# Altium project cjb.PrjPCB
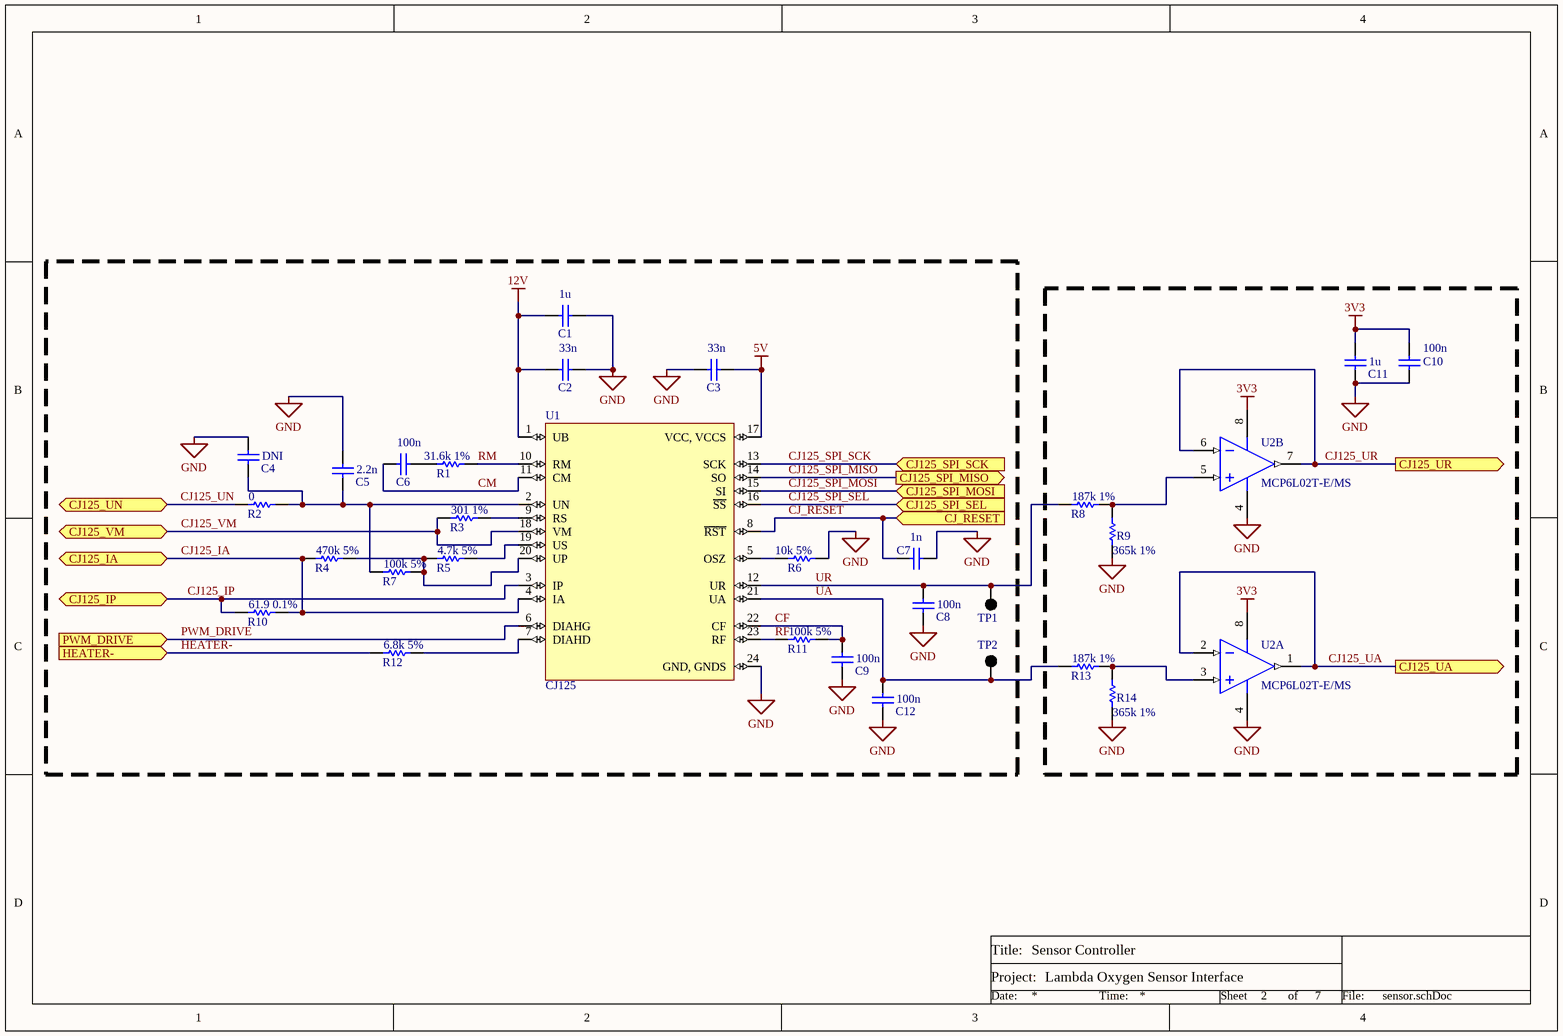
[diagram p0: sensor.schDoc]
ProjectTitle: Lambda Oxygen Sensor Interface
5 sheets, 113 parts. Net scope: hierarchical (ports join the sheet entries above them; power ports are global).
Board file: cjb.PcbDoc
Sheets:
  sensor.schDoc
  microcontroller.SchDoc
  power.SchDoc
  breakout.SchDoc
  thermocouple.SchDoc

## Sheet sensor.schDoc: Sensor Controller
size A4; SheetNumber: 2; SheetTotal: 7

### Parts
C1  value 1u  [1206]  (hidden comment: Generic 1206 Capacitor)
C2  value 33n  [0805]  (hidden comment: Generic 0805 Capacitor)
C3  value 33n  [0805]  (hidden comment: Generic 0805 Capacitor)
C4  value DNI  [0805]  (hidden comment: Generic 0805 Capacitor)
C5  value 2.2n  [0805]  (hidden comment: Generic 0805 Capacitor)
C6  value 100n  [0805]  (hidden comment: Generic 0805 Capacitor)
C7  value 1n  [0805]  (hidden comment: Generic 0805 Capacitor)
C8  value 100n  [0805]  (hidden comment: Generic 0805 Capacitor)
C9  value 100n  [0805]  (hidden comment: Generic 0805 Capacitor)
C10  value 100n  [0805]  (hidden comment: Generic 0805 Capacitor)
C11  value 1u  [1206]  (hidden comment: Generic 1206 Capacitor)
C12  value 100n  [0805]  (hidden comment: Generic 0805 Capacitor)
R1  value 31.6k 1%  [0603]  (hidden comment: Generic 0603 Resistor)
R2  value 0  [0603]  (hidden comment: Generic 0603 Resistor)
R3  value 301 1%  [0603]  (hidden comment: Generic 0603 Resistor)
R4  value 470k 5%  [0603]  (hidden comment: Generic 0603 Resistor)
R5  value 4.7k 5%  [0603]  (hidden comment: Generic 0603 Resistor)
R6  value 10k 5%  [0603]  (hidden comment: Generic 0603 Resistor)
R7  value 100k 5%  [0603]  (hidden comment: Generic 0603 Resistor)
R8  value 187k 1%  [0603]  (hidden comment: Generic 0603 Resistor)
R9  value 365k 1%  [0603]  (hidden comment: Generic 0603 Resistor)
R10  value 61.9 0.1%  [0603]  (hidden comment: Generic 0603 Resistor)
R11  value 100k 5%  [0603]  (hidden comment: Generic 0603 Resistor)
R12  value 6.8k 5%  [0603]  (hidden comment: Generic 0603 Resistor)
R13  value 187k 1%  [0603]  (hidden comment: Generic 0603 Resistor)
R14  value 365k 1%  [0603]  (hidden comment: Generic 0603 Resistor)
TP1  5001  [KSTN-5001]  (value not drawn)
TP2  5001  [KSTN-5001]  (value not drawn)
U1  CJ125  [SOIC-24]
U2  MCP6L02T-E/MS  [MSOP8_M]  (parts A,B of 2)

### Ports
CJ125_IA (bidir), CJ125_IP (bidir), CJ125_SPI_MISO (out), CJ125_SPI_MOSI (in), CJ125_SPI_SCK (in), CJ125_SPI_SEL (in), CJ125_UA (out), CJ125_UN (bidir), CJ125_UR (out), CJ125_VM (bidir), CJ_RESET (in), HEATER- (in), PWM_DRIVE (in)

### Nets
3V3: C10.2 C11.2 U2.8(VDD)
5V: C3.1 U1.17(VCC,_VCCS)
12V: C1.1 C2.2 U1.1(UB)
GND: C1.2 C2.1 C3.2 C4.2 C5.2 C7.2 C8.1 C9.1 C10.1 C11.1 C12.1 R6.2 R9.1 R14.1 U1.24(GND,_GNDS) U2.4(VSS)
CF: C9.2 R11.2 U1.22(CF)
CJ125_IA: R4.1 R10.2 U1.4(IA) ; port CJ125_IA
CJ125_IP: R10.1 U1.3(IP) ; port CJ125_IP
CJ125_SPI_MISO: U1.14(SO) ; port CJ125_SPI_MISO
CJ125_SPI_MOSI: U1.15(SI) ; port CJ125_SPI_MOSI
CJ125_SPI_SCK: U1.13(SCK) ; port CJ125_SPI_SCK
CJ125_SPI_SEL: U1.16(~{SS}) ; port CJ125_SPI_SEL
CJ125_UA: U2.1(VOUTA) U2.2(VINA-) ; port CJ125_UA
CJ125_UN: R2.1 ; port CJ125_UN
CJ125_UR: U2.6(VINB-) U2.7(VOUTB) ; port CJ125_UR
CJ125_VM: R3.1 U1.18(VM) ; port CJ125_VM
CJ_RESET: C7.1 U1.8(~{RST}) ; port CJ_RESET
CM: C6.1 U1.11(CM)
HEATER-: R12.1 ; port HEATER-
PWM_DRIVE: U1.6(DIAHG) ; port PWM_DRIVE
RF: R11.1 U1.23(RF)
RM: R1.2 U1.10(RM)
UA: C12.2 R13.1 TP2.1 U1.21(UA)
UR: C8.2 R8.1 TP1.1 U1.12(UR)
NetC4_1: C4.1 C5.1 R2.2 R7.1 U1.2(UN)
NetC6_2: C6.2 R1.1
NetR3_2: R3.2 U1.9(RS)
NetR4_2: R4.2 R5.1 R7.2 U1.20(UP)
NetR5_2: R5.2 U1.19(US)
NetR6_1: R6.1 U1.5(OSZ)
NetR8_2: R8.2 R9.2 U2.5(VINB+)
NetR12_2: R12.2 U1.7(DIAHD)
NetR13_2: R13.2 R14.2 U2.3(VINA+)

### Notes on the sheet
- Title:
- Project:
- Date:
- Time:
- Sheet
- of
- File:
- Title
- Size:
- E
- Number:
- Revision:

### Library data of the parts
C1 C11 = C_1206: Specifications: *
C2-C10 C12 = C_0805: Specifications: *
R1-R14 = R_0603: Specifications: *
TP1 TP2 = TP5001: Test Point, Black, 1-Pin THD, RoHS, Bulk; Manufacturer: Keystone; Other Names: 5001K; Catalog Drawings: 5000Series; Alternate Color: 5004K-ND / -TESTPOINTPCMINI.040"DYELLOW / 5003K-ND / -TESTPOINTPCMINI.040"DORANGE / 5002K-ND / -TESTPOINTPCMINI.040"DWHITE / 5000K-ND / -TESTPOINTPCMINI.040"DRED; Kits: DKTGRS232C-KIT-ND / -TTLCONVERTER; Online Catalog: ColorCodedTestPoints; Datasheet URL: https://ciiva.com/datasheet-click-2917627?src=ciiva&sig=bd195616; Mounting Type: 0.040"(1.02mm)HoleDiameter; Family: TestPoints; RoHS Information: RoHSComplianceStatement; Datasheet Version: Rev. G, 12/2008; Color: Black; Category: TestandMeasurement; Standard Package: 100; Manufacturer URL: http://www.keyelco.com/; Material: Base,Nylon46,UL94V-0; Type: PCTestPoint,Miniature; Terminal: 0.010"x0.020"(0.25mmx0.51mm)PhosphorBronzeWire,SilverPlated; Series: THM; Packaging: Bulk
U1 = CJ125: 5V 2Mbaud SMT Lambda Probe Interface IC - SOIC-24; Supplier 1: Future Electronics; Package Reference: SOIC-24; Supplier Part Number 1: 0272240104
U2 = MCP6L02: 1 MHz, 85 Î¼A Dual Op Amp, 8-Pin MSOP, Extended Temperature Range, Tape and Reel; ComponentLink2URL: http://ww1.microchip.com/downloads/en/DeviceDoc/22140b.pdf; PackageDescription: 8-Lead Plastic Micro Small Outline Package (MS) [MSOP]; ComponentLink1URL: http://www.microchip.com/; ComponentLink1Description: Manufacturer URL; RevisionNote: URLs added. DatasheetVersion updated.; PackageVersion: revBB, Aug-2009; ComponentLink3URL: http://www.microchip.com/stellent/groups/techpub_sg/documents/packagingspec/en012702.pdf; ComponentLink2Description: Datasheet; ComponentLink3Description: Package Specification; DatasheetVersion: revB, Sep-2011; PackageReference: MSOP-MS8

## Sheet microcontroller.SchDoc: Microcontroller
size A4; SheetNumber: 3; SheetTotal: 7
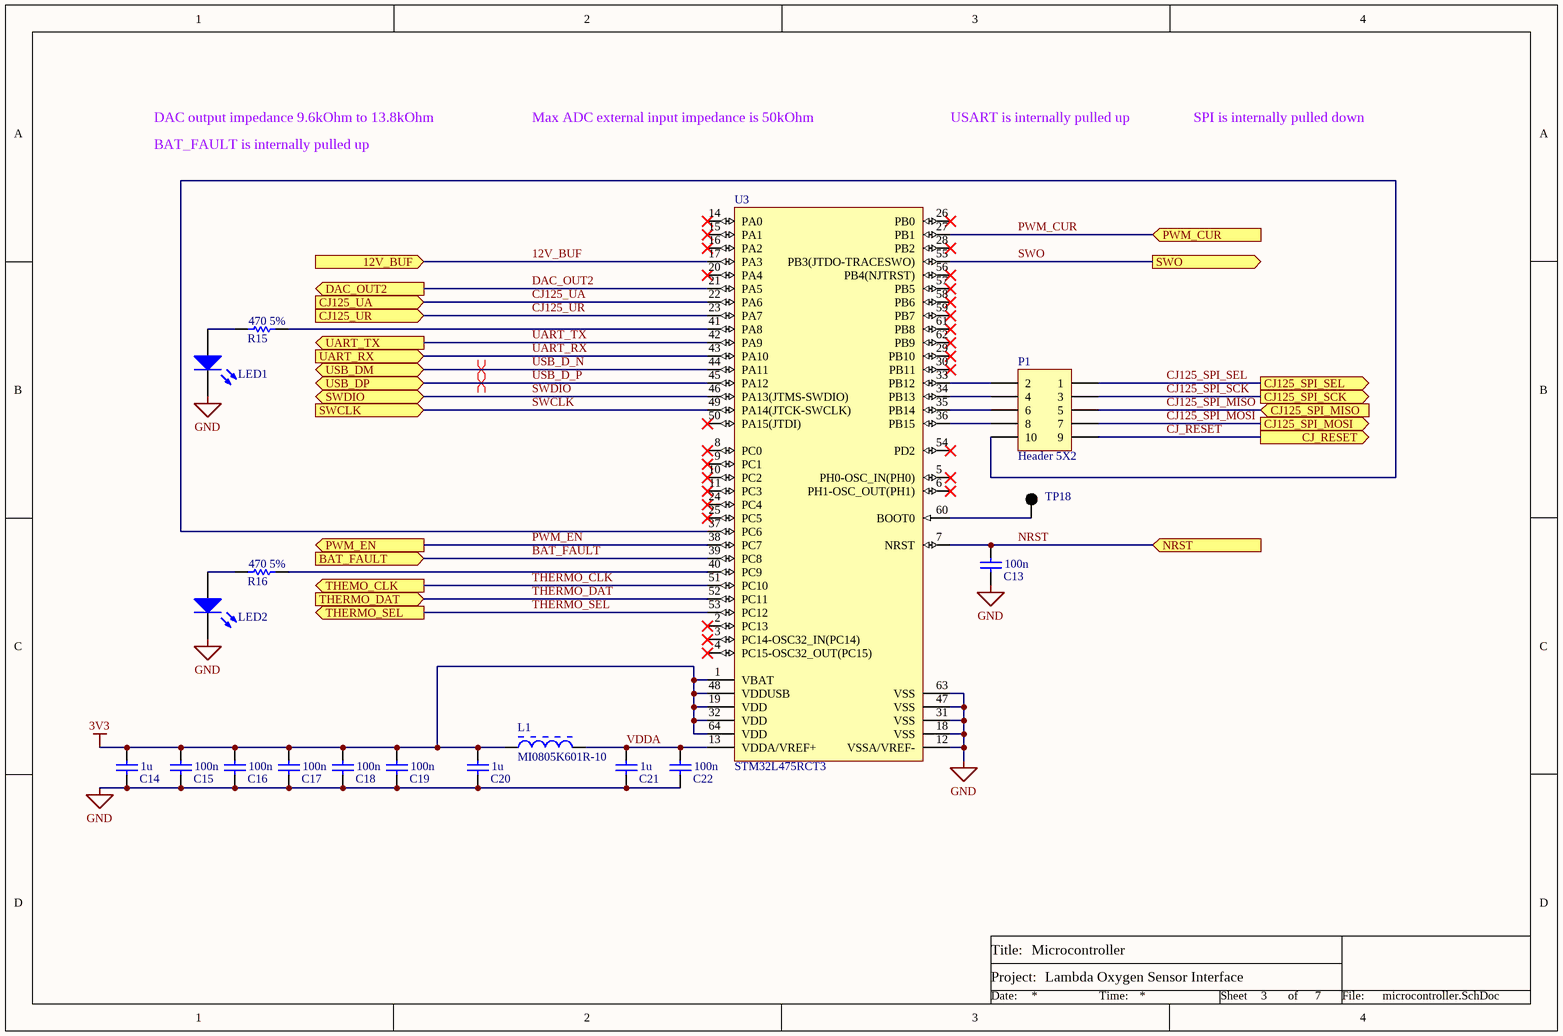
[diagram p1: microcontroller.SchDoc]

### Parts
C13  value 100n  [0805]  (hidden comment: Generic 0805 Capacitor)
C14  value 1u  [1206]  (hidden comment: Generic 1206 Capacitor)
C15  value 100n  [0805]  (hidden comment: Generic 0805 Capacitor)
C16  value 100n  [0805]  (hidden comment: Generic 0805 Capacitor)
C17  value 100n  [0805]  (hidden comment: Generic 0805 Capacitor)
C18  value 100n  [0805]  (hidden comment: Generic 0805 Capacitor)
C19  value 100n  [0805]  (hidden comment: Generic 0805 Capacitor)
C20  value 1u  [1206]  (hidden comment: Generic 1206 Capacitor)
C21  value 1u  [1206]  (hidden comment: Generic 1206 Capacitor)
C22  value 100n  [0805]  (hidden comment: Generic 0805 Capacitor)
L1  MI0805K601R-10  [0805]
LED1  150080SS75000  [0805_A]  (value not drawn)
LED2  150080SS75000  [0805_A]  (value not drawn)
P1  Header 5X2  [HDR2X5]
R15  value 470 5%  [0603]  (hidden comment: Generic 0603 Resistor)
R16  value 470 5%  [0603]  (hidden comment: Generic 0603 Resistor)
TP18  5001  [KSTN-5001]  (value not drawn)
U3  STM32L475RCT3  [STM-LQFP64_L]

### Ports
12V_BUF (in), BAT_FAULT (in), CJ125_SPI_MISO (in), CJ125_SPI_MOSI (out), CJ125_SPI_SCK (out), CJ125_SPI_SEL (out), CJ125_UA (in), CJ125_UR (in), CJ_RESET (out), DAC_OUT2 (out), NRST (in), PWM_CUR (in), PWM_EN (out), SWCLK (in), SWDIO (bidir), SWO (out), THEMO_CLK (out), THERMO_DAT (in), THERMO_SEL (out), UART_RX (in), UART_TX (out), USB_DM (bidir), USB_DP (bidir)

### Nets
3V3: C14.2 C15.2 C16.2 C17.2 C18.2 C19.2 C20.2 L1.1 U3.1(VBAT) U3.19(VDD) U3.32(VDD) U3.48(VDDUSB) U3.64(VDD)
GND: C13.1 C14.1 C15.1 C16.1 C17.1 C18.1 C19.1 C20.1 C21.1 C22.1 LED1.1(K) LED2.1(K) U3.12(VSSA/VREF-) U3.18(VSS) U3.31(VSS) U3.47(VSS) U3.63(VSS)
12V_BUF: U3.17(PA3) ; port 12V_BUF
BAT_FAULT: U3.39(PC8) ; port BAT_FAULT
CJ125_SPI_MISO: P1.5 ; port CJ125_SPI_MISO
CJ125_SPI_MOSI: P1.7 ; port CJ125_SPI_MOSI
CJ125_SPI_SCK: P1.3 ; port CJ125_SPI_SCK
CJ125_SPI_SEL: P1.1 ; port CJ125_SPI_SEL
CJ125_UA: U3.22(PA6) ; port CJ125_UA
CJ125_UR: U3.23(PA7) ; port CJ125_UR
CJ_RESET: P1.9 ; port CJ_RESET
DAC_OUT2: U3.21(PA5) ; port DAC_OUT2
NRST: C13.2 U3.7(NRST) ; port NRST
PWM_CUR: U3.27(PB1) ; port PWM_CUR
PWM_EN: U3.38(PC7) ; port PWM_EN
SWCLK: U3.49(PA14(JTCK-SWCLK)) ; port SWCLK
SWDIO: U3.46(PA13(JTMS-SWDIO)) ; port SWDIO
SWO: U3.55(PB3(JTDO-TRACESWO)) ; port SWO
THERMO_CLK: U3.51(PC10) ; port THEMO_CLK
THERMO_DAT: U3.52(PC11) ; port THERMO_DAT
THERMO_SEL: U3.53(PC12) ; port THERMO_SEL
UART_RX: U3.43(PA10) ; port UART_RX
UART_TX: U3.42(PA9) ; port UART_TX
USB_D_N: U3.44(PA11) ; port USB_DM
USB_D_P: U3.45(PA12) ; port USB_DP
VDDA: C21.2 C22.2 L1.2 U3.13(VDDA/VREF+)
NetLED1_2: LED1.2(A) R15.1
NetLED2_2: LED2.2(A) R16.1
NetP1_2: P1.2 U3.33(PB12)
NetP1_4: P1.4 U3.34(PB13)
NetP1_6: P1.6 U3.35(PB14)
NetP1_8: P1.8 U3.36(PB15)
NetP1_10: P1.10 U3.37(PC6)
NetR15_2: R15.2 U3.41(PA8)
NetR16_2: R16.2 U3.40(PC9)
NetTP18_1: TP18.1 U3.60(BOOT0)

Not connected (* = marked no-connect by the designer): U3 2(PC13)* 3(PC14-OSC32_IN(PC14))* 4(PC15-OSC32_OUT(PC15))* 5(PH0-OSC_IN(PH0))* 6(PH1-OSC_OUT(PH1))* 8(PC0)* 9(PC1)* 10(PC2)* 11(PC3)* 14(PA0)* 15(PA1)* 16(PA2)* 20(PA4)* 24(PC4)* 25(PC5)* 26(PB0)* 28(PB2)* 29(PB10)* 30(PB11)* 50(PA15(JTDI))* 54(PD2)* 56(PB4(NJTRST))* 57(PB5)* 58(PB6)* 59(PB7)* 61(PB8)* 62(PB9)*

### Layout directives
differential pair: USB_D_N, USB_D_P

### Notes on the sheet
- DAC output impedance 9.6kOhm to 13.8kOhm
- BAT_FAULT is internally pulled up
- Max ADC external input impedance is 50kOhm
- USART is internally pulled up
- SPI is internally pulled down
- Title
- Title:
- Project:
- Size:
- Date:
- File:
- E
- Number:
- Time:
- Revision:
- Sheet
- of

### Library data of the parts
C13 C15-C19 C22 = C_0805: Specifications: *
C14 C20 C21 = C_1206: Specifications: *
L1 = MI0805K: Chip Bead for Power Filtering, 1500 mA, 600 Ohm, -40 to 125 degC, 0805 (2012 Metric), RoHS, Tape and Reel; Manufacturer: Laird; Filter Type: PowerLine; Current Rating (Max): 1.5A; Catalog Drawings: (HI,HZ,LI,MI)0805Series_1.10mmMax.Height; Impedance @ Frequency: 600Ohm@100MHz; Number of Lines: 1; DC Resistance (DCR) (Max): 100mOhm; Other Names: 240-2390-1; Kits: 240-2227-ND-KITEMIFERRITEBEADCHIPSMD; Online Catalog: MISeries; Standard Package: 1; Datasheet Version: Rev. A, 01/2004; Height (Max): 0.043"(1.10mm); Category: Filters; Operating Temperature: -40degC~125degC; Package Description: 2-Pin Surface Mount Device, Body 2 x 1.25 mm; Package / Case: 0805(2012Metric); Package Reference: MI0805K601R-10-2; Packaging: CutTape(CT); Ratings: -; Mounting Type: SurfaceMount; Datasheet URL: https://datasheet.ciiva.com/3082/mi0805k601r-10-a-vp-3082219.pdf; Size / Dimension: 0.079"Lx0.049"W(2.00mmx1.25mm); Family: FerriteBeadsandChips; Manufacturer URL: https://www.lairdtech.com; Series: MI
LED1 LED2 = LED_0805: SMD mono-color Chip LED, WL-SMCW, Super Red; Manufacturer: Wuerth Elektronik; PackageReference: 0805_A; ComponentLink2URL: http://katalog.we-online.com/led/datasheet/150080SS75000.pdf; ComponentLink1URL: http://www.we-online.com; Color: Super Red; ComponentLink2Description: Datasheet; ComponentLink1Description: Manufacturer URL; PartNumber: 150080SS75000
P1 = Header 5X2: Header, 5-Pin, Dual row; LatestRevisionDate: 17-Jul-2002; LatestRevisionNote: Re-released for DXP Platform.; Publisher: Altium Limited
R15 R16 = R_0603: Specifications: *
TP18 = TP5001: as TP1 on sheet sensor; Datasheet URL: https://ciiva.com/datasheet-click-2917627?src=ciiva&sig=bd195616; Mounting Type: 0.040"(1.02mm)HoleDiameter; Family: TestPoints; RoHS Information: RoHSComplianceStatement; Datasheet Version: Rev. G, 12/2008; Color: Black; Category: TestandMeasurement; Standard Package: 100; Manufacturer URL: http://www.keyelco.com/; Material: Base,Nylon46,UL94V-0; Type: PCTestPoint,Miniature; Terminal: 0.010"x0.020"(0.25mmx0.51mm)PhosphorBronzeWire,SilverPlated; Series: THM; Packaging: Bulk
U3 = STM32L475RCT3: Ultra-Low-Power ARM Cortex-M4 32-bit MCU+FPU, 256 KB Flash, 128 KB Internal RAM, 51 I/Os, 64-Pin LQFP, -40 to 125 degC, Tray; Operating Frequency(F) (Processor speed) (MHz): 80; Internal RAM Size (kB): 128; I/Os (High Current): 51; D/A Converter: 2; Supply Voltage(Vcc) min (V): 1.71; FLASH Size (Prog) (kB): 256; Package: LQFP64; Packing: Tray; DatasheetVersion: Rev. 4; Mounting Technology: Surface Mount; Core: ARM Cortex-M4; Package Description: 64-Pin Low-profile Quad Flat Package, Body 10 x 10 mm, Pitch 0.5 mm; ComponentLink1Description: Datasheet; ComponentLink1URL: http://www.st.com/content/ccc/resource/technical/document/datasheet/90/51/73/d2/53/60/4f/5f/DM00172872.pdf/files/DM00172872.pdf/jcr:content/translations/en.DM00172872.pdf; Supplier 1: Digi-Key; Supplier Part Number 1: 497-16840-ND

## Sheet power.SchDoc: Power
size A4; SheetNumber: 4; SheetTotal: 7
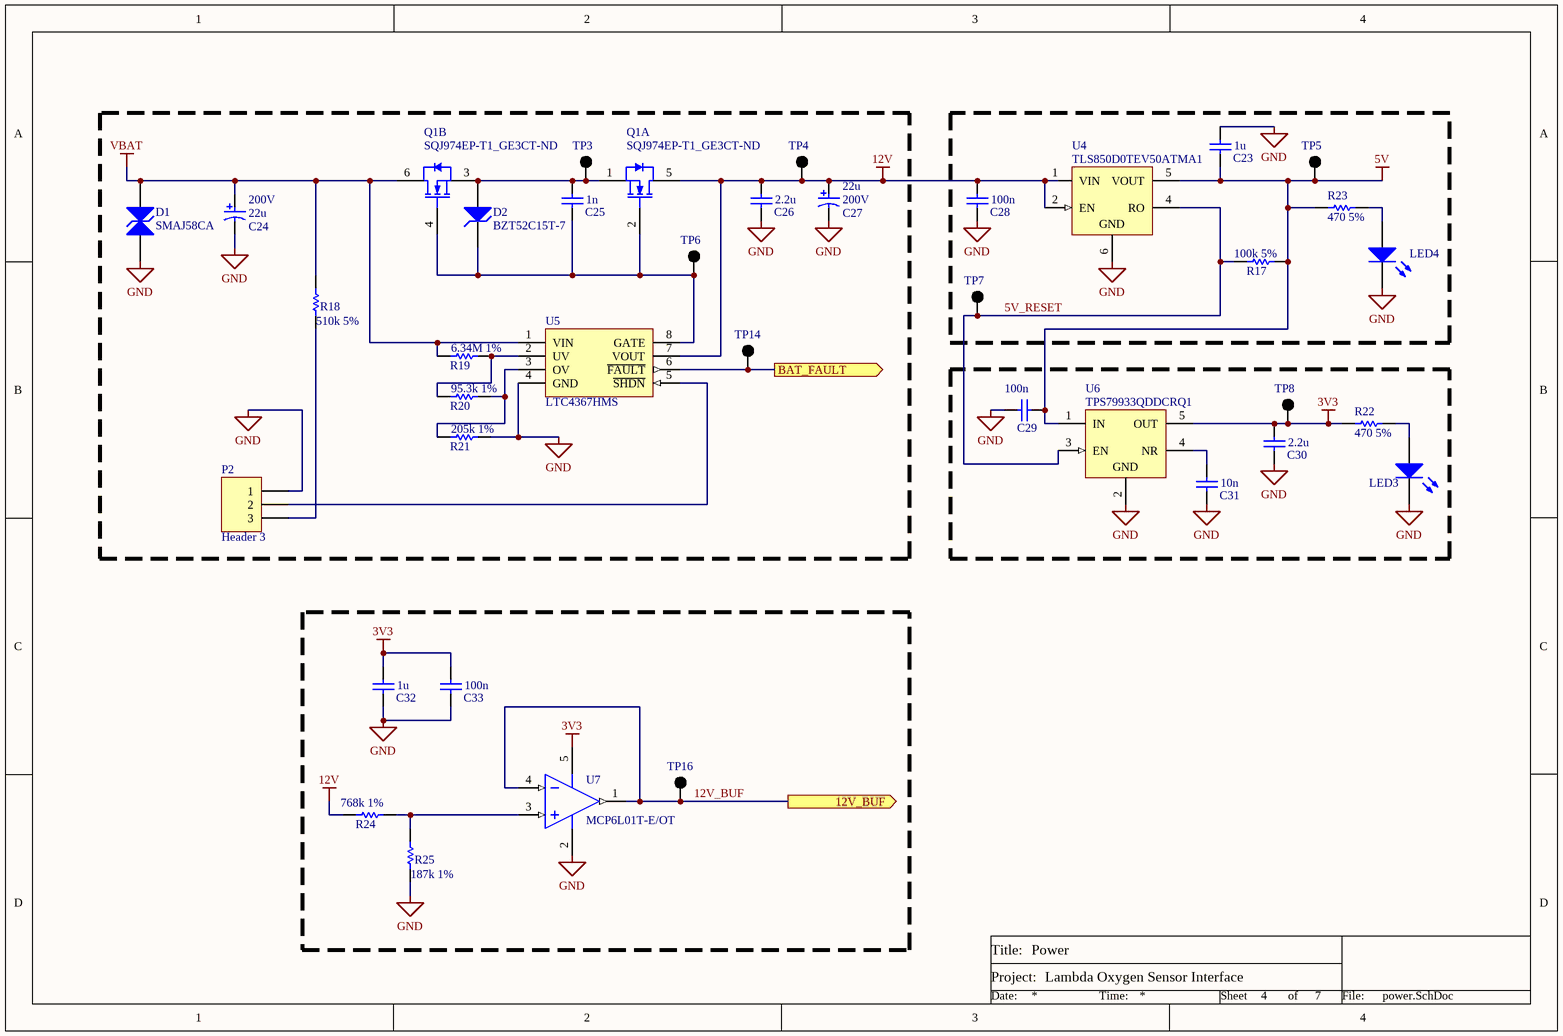
[diagram p2: power.SchDoc]

### Parts
C23  value 1u  [1206]  (hidden comment: Generic 1206 Capacitor)
C24  value 22u  Voltage: 200V  [NIC-UUX2A470MNL1GS_M]  (hidden comment: Generic Electrolytic Capacitor)
C25  value 1n  [0805]  (hidden comment: Generic 0805 Capacitor)
C26  value 2.2u  [1206]  (hidden comment: Generic 1206 Capacitor)
C27  value 22u  Voltage: 200V  [NIC-UUX2A470MNL1GS_M]  (hidden comment: Generic Electrolytic Capacitor)
C28  value 100n  [0805]  (hidden comment: Generic 0805 Capacitor)
C29  value 100n  [0805]  (hidden comment: Generic 0805 Capacitor)
C30  value 2.2u  [1206]  (hidden comment: Generic 1206 Capacitor)
C31  value 10n  [0805]  (hidden comment: Generic 0805 Capacitor)
C32  value 1u  [1206]  (hidden comment: Generic 1206 Capacitor)
C33  value 100n  [0805]  (hidden comment: Generic 0805 Capacitor)
D1  SMAJ58CA  [VISH-DO-214AC-2_M]
D2  BZT52C15T-7  [DIOD-SOD523-2_V]
LED3  150080SS75000  [0805_A]  (value not drawn)
LED4  150080SS75000  [0805_A]  (value not drawn)
P2  Header 3  [HDR1X3]
Q1  SQJ974EP-T1_GE3CT-ND  [VISH-POWERPAKSO-8_A_V]  (parts A,B of 2)
R17  value 100k 5%  [0603]  (hidden comment: Generic 0603 Resistor)
R18  value 510k 5%  [0603]  (hidden comment: Generic 0603 Resistor)
R19  value 6.34M 1%  [0603]  (hidden comment: Generic 0603 Resistor)
R20  value 95.3k 1%  [0603]  (hidden comment: Generic 0603 Resistor)
R21  value 205k 1%  [0603]  (hidden comment: Generic 0603 Resistor)
R22  value 470 5%  [0603]  (hidden comment: Generic 0603 Resistor)
R23  value 470 5%  [0603]  (hidden comment: Generic 0603 Resistor)
R24  value 768k 1%  [0603]  (hidden comment: Generic 0603 Resistor)
R25  value 187k 1%  [0603]  (hidden comment: Generic 0603 Resistor)
TP3  5001  [KSTN-5001]  (value not drawn)
TP4  5001  [KSTN-5001]  (value not drawn)
TP5  5001  [KSTN-5001]  (value not drawn)
TP6  5001  [KSTN-5001]  (value not drawn)
TP7  5001  [KSTN-5001]  (value not drawn)
TP8  5001  [KSTN-5001]  (value not drawn)
TP14  5001  [KSTN-5001]  (value not drawn)
TP16  5001  [KSTN-5001]  (value not drawn)
U4  TLS850D0TEV50ATMA1  [KVU0005A_M]
U5  LTC4367HMS  [MSOP8_M]
U6  TPS79933QDDCRQ1  [DDC0005A_M]
U7  MCP6L01T-E/OT  [DDC0005A_M]

### Ports
12V_BUF (out), BAT_FAULT (out)

### Nets
3V3: C30.2 C32.2 C33.2 R22.2 TP8.1 U6.5(OUT) U7.5(VDD)
5V: C23.1 C29.2 R17.2 R23.2 TP5.1 U4.5(VOUT) U6.1(IN)
12V: C26.2 C27.1 C28.2 Q1.5(G2) R24.1 TP4.1 U4.1(VIN) U4.2(EN) U5.7(VOUT)
GND: C23.2 C24.2 C26.1 C27.2 C28.1 C29.1 C30.1 C31.1 C32.1 C33.1 D1.1(A1) LED3.1(K) LED4.1(K) P2.1 R21.2 R25.1 U4.6(GND) U5.4(GND) U6.2(GND) U7.2(VSS)
VBAT: C24.1 D1.2(A2) Q1.6(G2) R18.2 R19.1 U5.1(VIN)
5V_RESET: R17.1 TP7.1 U4.4(RO) U6.3(EN)
12V_BUF: TP16.1 U7.1(VOUT) U7.4(VIN-) ; port 12V_BUF
BAT_FAULT: TP14.1 U5.6(~{FAULT}) ; port BAT_FAULT
NetC25_1: C25.1 D2.2(K) Q1.2(G2) Q1.4(G2) TP6.1 U5.8(GATE)
NetC25_2: C25.2 D2.1(A) Q1.1(S2) Q1.3(S2) TP3.1
NetC31_2: C31.2 U6.4(NR)
NetLED3_2: LED3.2(A) R22.1
NetLED4_2: LED4.2(A) R23.1
NetP2_2: P2.2 U5.5(~{SHDN})
NetP2_3: P2.3 R18.1
NetR19_2: R19.2 R20.1 U5.2(UV)
NetR20_2: R20.2 R21.1 U5.3(OV)
NetR24_2: R24.2 R25.2 U7.3(VIN+)

### Notes on the sheet
- Title
- Title:
- Project:
- Size:
- Date:
- File:
- E
- Number:
- Time:
- Revision:
- Sheet
- of

### Library data of the parts
C23 C26 C30 C32 = C_1206: Specifications: *
C24 C27 = C_can: Generic PCAP_10x10 Can Aluminum Electrolytic Capacitor
C25 C28 C29 C31 C33 = C_0805: Specifications: *
D1 = SMAJ58CA: Transient Voltage Suppressor, 6.40 to 231 V, 58 V Stand-off Voltage, Bi-Directional, -55 to 155 degC, 2-pin DO-214AC, Pb-Free, Tape and Reel; Manufacturer: Vishay Semiconductor; PartNumber: SMAJ58CA-E3/5A; VWM (V): 58; IFSM: 40 A; VBR Bi-Directional (V): 6.4 to 231; ID (uA): 2; PPPM (W): 400, 300; ComponentLink2Description: Datasheet; ComponentLink1URL: http://www.vishay.com/; ComponentLink2URL: http://www.vishay.com/docs/88390/smaj50a.pdf; PackageReference: DO-214AC-2; Operating Junction and Storage Temperature Range: -55 to 150 degC; DatasheetVersion: 12/8/2013; ComponentLink3Description: Package Specification; RoHS: TRUE; Mounting Technology: Surface Mount; ComponentLink1Description: Manufacturer URL; PackageDescription: 2-Pin DO-214AC (SMA), Body 4.245 x 2.665 mm; ComponentLink3URL: http://www.vishay.com/docs/88390/smaj50a.pdf; Packing: Tape and Reel; Supplier 1: Digi-Key; Supplier Part Number 1: SMAJ58CALFCT-ND
D2 = BZT52C15T: Zener Diode 15V 300mW ±6% Surface Mount SOD-523; Manufacturer: Diodes Inc; PartNumber: BZT52C16-7-F; Maximum Reverse Current: 0.1 uA; Tol V: 5.56% Typ.; Maximum Zener Impedance f: 1 kHz ZZK=200 Ohm; Voltage Zener: 16 V Typ.; Packing: Tape and Reel; Power Max: 500 mW; ComponentLink2URL: http://www.diodes.com/datasheets/ds18004.pdf; PackageDescription: 2-Pin SOD123, Body 2.7 x 1.55 mm, Height 1.45 mm; ComponentLink3Description: Package Specification; Mounting Technology: Surface Mount; PackageReference: SOD123; ComponentLink2Description: Datasheet; RoHS: TRUE; ComponentLink3URL: http://www.diodes.com/datasheets/ap02002.pdf; Operating Temperature: -65 to 150 degC; DatasheetVersion: Rev. 37-2; ComponentLink1Description: Manufacturer URL; ComponentLink1URL: http://www.diodes.com/; PackageVersion: Rev. 79
LED3 LED4 = LED_0805: as LED1 on sheet microcontroller; PackageReference: 0805_A; ComponentLink2URL: http://katalog.we-online.com/led/datasheet/150080SS75000.pdf; ComponentLink1URL: http://www.we-online.com; Color: Super Red; ComponentLink2Description: Datasheet; ComponentLink1Description: Manufacturer URL; PartNumber: 150080SS75000
P2 = Header 3: Header, 3-Pin; LatestRevisionDate: 17-Jul-2002; LatestRevisionNote: Re-released for DXP Platform.; Publisher: Altium Limited
Q1 = SQJ974EP: Mosfet Array 2 N-Channel (Dual) 100V 30A (Tc) 48W Surface Mount PowerPAK® SO-8 Dual; Manufacturer: Vishay; Gate Charge (Qg) @ Vgs: 15nC@10V; FET Feature: Standard; Rds On (Max) @ Id, Vgs: 19mOhm@10A,10V; Drain to Source Voltage (Vdss): 40V; Other Names: SI7288DP-T1-GE3DKR; Online Catalog: N-ChannelStandardFETs; Power - Max: 15.6W; PCN Assembly/Origin: MultipleFabracationChanges09/Jul/2014; Input Capacitance (Ciss) @ Vds: 565pF@20V; Current - Continuous Drain (Id) @ 25°C: 20A; Vgs(th) (Max) @ Id: 2.8V@250µA; Package Reference: POWERPAKSO-8; Datasheet URL: http://www.vishay.com/docs/65366/si7288dp.pdf; Package Description: 8-Pin Surface Mount Device, Body 6.15 x 5.155 mm, Pitch 1.27 mm; Manufacturer URL: http://www.vishay.com/; Package / Case: PowerPAK®SO-8Dual; Category: DiscreteSemiconductorProducts; Mounting Type: SurfaceMount; Standard Package: 1; Mounting Technology: SurfaceMount; Series: TrenchFET®; Datasheet Version: Rev. A, 10/2009; Supplier Device Package: PowerPAK®SO-8Dual; Family: FETs-Arrays; Packaging: Digi-Reel®; FET Type: 2N-Channel(Dual)
R17-R25 = R_0603: Specifications: *
TP3-TP8 TP14 TP16 = TP5001: as TP1 on sheet sensor; Datasheet URL: https://ciiva.com/datasheet-click-2917627?src=ciiva&sig=bd195616; Mounting Type: 0.040"(1.02mm)HoleDiameter; Family: TestPoints; RoHS Information: RoHSComplianceStatement; Datasheet Version: Rev. G, 12/2008; Color: Black; Category: TestandMeasurement; Standard Package: 100; Manufacturer URL: http://www.keyelco.com/; Material: Base,Nylon46,UL94V-0; Type: PCTestPoint,Miniature; Terminal: 0.010"x0.020"(0.25mmx0.51mm)PhosphorBronzeWire,SilverPlated; Series: THM; Packaging: Bulk
U4 = TLS850D0TE: Linear Voltage Regulator IC  1 Output  500mA PG-TO252-5; PartNumber: TPS7A6150QKVURQ1; Manufacturer: Texas Instruments; Vin(Min)(V): 4; Fixed Output Options(V): 5; Vdo(Typ)(mV): 300; Accuracy(%): 2; Iq(Typ)(mA): 0.02; Iout(Max)(A): 0.3; SubFamily: Single Channel LDO; Vin(Max)(V): 40; Eco-Plan: Green (RoHS & no Sb/Br); PackageReference: KVU0005A; ComponentLink2URL: http://www.ti.com/general/docs/lit/getliterature.tsp?genericPartNumber=TPS7A6150-Q1&fileType=pdf; PackageDescription: 5-Pin Plastic Flange Mount, Body 6.1 x 6.6 mm, Pitch 1.14 mm; Vout Adj(Max)(V): 5; ComponentLink1Description: Manufacturer URL; ComponentLink1URL: http://www.ti.com/; DatasheetVersion: SLVSA62G; ComponentLink2Description: Datasheet; Mounting Technology: Surface Mount; PackageVersion: 4205521-3/D; Vout Adj(Min)(V): 5; ComponentLink3Description: Package Specification; Code_JEDEC: TO-252; ComponentLink3URL: http://www.ti.com/lit/ml/mpsf019/mpsf019.pdf; Supplier 1: Digi-Key; Supplier Part Number 1: 296-36856-6-ND
U5 = LTC4367: 100V Overvoltage, Undervoltage and Reverse Supply Protection Controller; ComponentLink1Description: Manufacturer URL; ComponentLink3Description: Package Specification; ComponentLink2URL: http://cds.linear.com/docs/en/datasheet/4356fa.pdf; ComponentLink3URL: http://cds.linear.com/docs/en/packaging/05081661_F_MS.pdf; ComponentLink1URL: http://www.linear.com/; ComponentLink2Description: Datasheet
U6 = TPS79933: Single Output High PSRR LDO, 200 mA, Fixed 3.3 V Output, 2.7 to 6.5 V Input, with Low IQ, 5-pin SOT (DDC), -40 to 125 degC, Green (RoHS & no Sb/Br); Manufacturer: Texas Instruments; Accuracy(%): 2; Vin(Max)(V): 6.5; SubFamily: Single Channel LDO; Iout(Max)(A): 0.2; Vdo(Typ)(mV): 90; Fixed Output Options(V): 3.3; Iq(Typ)(mA): 0.04; Rating: Automotive; Vin(Min)(V): 2.7; ComponentLink2Description: Datasheet; ComponentLink3Description: Package Specification; PackageVersion: 4204403-2/E; ComponentLink1URL: http://www.ti.com/; ComponentLink3URL: http://www.ti.com/litv/pdf/mpds123d; ComponentLink2URL: http://www.ti.com/general/docs/lit/getliterature.tsp?genericPartNumber=TPS79933-Q1&fileType=pdf; PackageReference: DDC0005A; PackageDescription: 5-Pin Plastic Small Outline, Body 2.9 x 1.6 mm, 0.95 mm Pitch; ComponentLink4Description: URL Link1; PartNumber: TPS79933QDDCRQ1; DatasheetVersion: SBVS097E; Mounting Technology: Surface Mount; ComponentLink1Description: Manufacturer URL; Eco-Plan: Green (RoHS & no Sb/Br); Vout Adj(Max)(V): 3.3; Vout Adj(Min)(V): 3.3; ComponentLink4URL: Samples URL:http://www.ti.com/product/tps79933-q1#samples; Code_JEDEC: MO-193
U7 = MCP6L01: 1 MHz, 85 uA Op Amp, 5-Pin SOT-23, Extended Temperature Range; Code_IPC: SOT23-5; ComponentLink3Description: Package Specification; PackageVersion: revBB, Aug-2009; ComponentLink3URL: http://www.microchip.com/stellent/groups/techpub_sg/documents/packagingspec/en012702.pdf; ComponentLink1Description: Manufacturer URL; DatasheetVersion: revB, Sep-2011; PackageDescription: 5-Lead Plastic Small Outline Transistor (OT) [SOT-23]; PackageReference: SOT-23-OT5; ComponentLink1URL: http://www.microchip.com/; ComponentLink2Description: Datasheet; ComponentLink2URL: http://ww1.microchip.com/downloads/en/DeviceDoc/22140b.pdf; RevisionNote: URLs added. DatasheetVersion updated.

## Sheet breakout.SchDoc: Pin Breakout
size A4; SheetNumber: 7; SheetTotal: 7
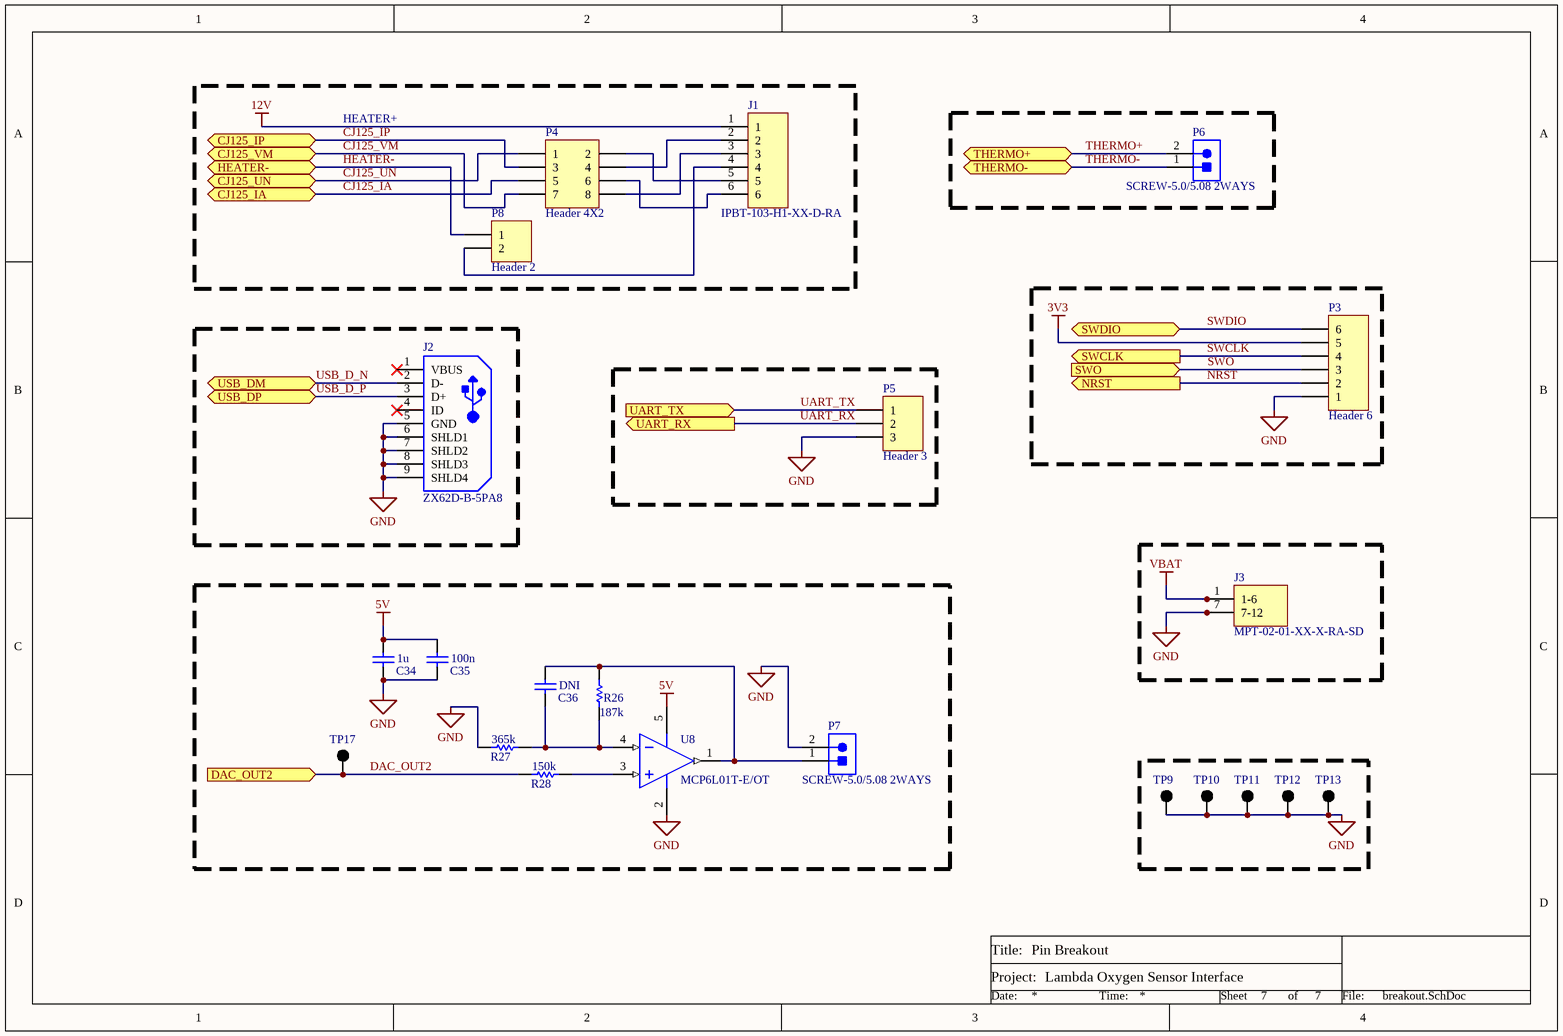
[diagram p3: breakout.SchDoc]

### Parts
C34  value 1u  [1206]  (hidden comment: Generic 1206 Capacitor)
C35  value 100n  [0805]  (hidden comment: Generic 0805 Capacitor)
C36  value DNI  [0805]  (hidden comment: Generic 0805 Capacitor)
J1  IPBT-103-H1-XX-D-RA  [IPBT-103-H1-XX-D-RA]
J2  ZX62D-B-5PA8  [HIRO-ZX62D-B-5PA8_V]
J3  MPT-02-01-XX-X-RA-SD  [MPT-02-01-XX-X-RA-SD]
P3  Header 6  [HDR1X6]
P4  Header 4X2  [HDR2X4]
P5  Header 3  [HDR1X3]
P6  SCREW-5.0/5.08 2WAYS  [Degson_DG126-5.0-02P-14]
P7  SCREW-5.0/5.08 2WAYS  [Degson_DG126-5.0-02P-14]
P8  Header 2  [HDR1X2]
R26  value 187k  [0603]  (hidden comment: Generic 0603 Resistor)
R27  value 365k  [0603]  (hidden comment: Generic 0603 Resistor)
R28  value 150k  [0603]  (hidden comment: Generic 0603 Resistor)
TP9  5001  [KSTN-5001]  (value not drawn)
TP10  5001  [KSTN-5001]  (value not drawn)
TP11  5001  [KSTN-5001]  (value not drawn)
TP12  5001  [KSTN-5001]  (value not drawn)
TP13  5001  [KSTN-5001]  (value not drawn)
TP17  5001  [KSTN-5001]  (value not drawn)
U8  MCP6L01T-E/OT  [DDC0005A_M]

### Blocks framed on the sheet
HEATER+: J1 P4 P8

### Ports
CJ125_IA (bidir), CJ125_IP (bidir), CJ125_UN (bidir), CJ125_VM (bidir), DAC_OUT2 (in), HEATER- (bidir), NRST (out), SWCLK (out), SWDIO (bidir), SWO (in), THERMO+ (bidir), THERMO- (bidir), UART_RX (out), UART_TX (in), USB_DM (bidir), USB_DP (bidir)

### Nets
3V3: P3.5
5V: C34.2 C35.2 U8.5(VDD)
12V: J1.1
GND: C34.1 C35.1 J2.5(GND) J2.6(SHLD1) J2.7(SHLD2) J2.8(SHLD3) J2.9(SHLD4) J3.7(7-12) J3.8 J3.9 J3.10 J3.11 J3.12 P3.1 P5.3 P7.2 R27.1 TP9.1 TP10.1 TP11.1 TP12.1 TP13.1 U8.2(VSS)
VBAT: J3.1(1-6) J3.2 J3.3 J3.4 J3.5 J3.6
CJ125_IA: P4.5 ; port CJ125_IA
CJ125_IP: P4.3 ; port CJ125_IP
CJ125_UN: P4.1 ; port CJ125_UN
CJ125_VM: P4.7 ; port CJ125_VM
DAC_OUT2: R28.1 TP17.1 ; port DAC_OUT2
HEATER-: P8.1 ; port HEATER-
NRST: P3.2 ; port NRST
SWCLK: P3.4 ; port SWCLK
SWDIO: P3.6 ; port SWDIO
SWO: P3.3 ; port SWO
THERMO+: P6.2 ; port THERMO+
THERMO-: P6.1 ; port THERMO-
UART_RX: P5.2 ; port UART_RX
UART_TX: P5.1 ; port UART_TX
USB_D_N: J2.2(D-) ; port USB_DM
USB_D_P: J2.3(D+) ; port USB_DP
NetC36_1: C36.1 R26.1 R27.2 U8.4(VIN-)
NetC36_2: C36.2 P7.1 R26.2 U8.1(VOUT)
NetJ1_2: J1.2 P4.4
NetJ1_3: J1.3 P4.8
NetJ1_4: J1.4 P8.2
NetJ1_5: J1.5 P4.2
NetJ1_6: J1.6 P4.6
NetR28_2: R28.2 U8.3(VIN+)

Not connected (* = marked no-connect by the designer): J2 1(VBUS)* 4(ID)*

### Notes on the sheet
- Title
- Title:
- Project:
- Size:
- Date:
- File:
- E
- Number:
- Time:
- Revision:
- Sheet
- of

### Library data of the parts
C34 = C_1206: Specifications: *
C35 C36 = C_0805: Specifications: *
J1 = IPBT-103-H1-XX-D-RA: 0.165 INCH DOUBLE ROW TERMINAL ASSEMBLY; ComponentLink1Description: Manufacturer URL; ComponentLink3Description: Package Specification; ComponentLink2URL: http://cds.linear.com/docs/en/datasheet/4356fa.pdf; ComponentLink3URL: http://cds.linear.com/docs/en/packaging/05081661_F_MS.pdf; ComponentLink1URL: http://www.linear.com/; ComponentLink2Description: Datasheet
J2 = Micro_USB: Micro-USB Connector Meeting USB 2.0 Standard, -30 to 85 degC, 5-Pin SMD, RoHS, Tape and Reel; Manufacturer: HiroseElectric; Number of Contacts: 5Contact; Current Rating: 1A; Brand: HiroseConnector; Number of Ports: 1Port; Voltage Rating: 30V; Mounting Angle: Right; Gender: Male; Connector Type: Receptacle; RoHS: Details; Package Reference: ZX62D-B-5PA8; Contact Plating: Gold; Product: MicroUSBTypeBConnectors; Shell Plating: Tin; Datasheet Version: 08/2010; Factory Pack Quantity: 2000; Manufacturer URL: https://www.hirose.com; Standard: USB2.0; Datasheet URL: https://datasheet.ciiva.com/22825/0900766b8118f7b1-22825836.pdf; Package Description: 5-Pin Surface Mount Device, Body 7.5 x 5 mm, Pitch 0.65 mm; Operating Temperature Range: -30Cto+85C; Series: ZX; Contact Material: CopperAlloy; Color: Black; Mounting Technology: SurfaceMount; Product Category: USBConnectors; Termination Style: Solder; Packaging: Reel
P3 = Header 6: Header, 6-Pin; LatestRevisionDate: 17-Jul-2002; LatestRevisionNote: Re-released for DXP Platform.; Publisher: Altium Limited
P4 = Header 4X2: Header, 4-Pin, Dual row; LatestRevisionDate: 17-Jul-2002; LatestRevisionNote: Re-released for DXP Platform.; Publisher: Altium Limited
P5 = Header 3: Header, 3-Pin; LatestRevisionDate: 17-Jul-2002; LatestRevisionNote: Re-released for DXP Platform.; Publisher: Altium Limited
P6 P7 = Screw_Header_2: Socket, Screw Terminal Block, 2 Way, 5.0 mm Pitch, 90 Degree Angle, Through-Hole; Manufacturer: No Vendor; Insulation Resistance: 5000 MOhm / 1000 V; Contact Resistance: 20 mOhm; Rated Current: 25 A; Poles: 2; Rated Voltage: 300 V; PartNumber: SCREW-5.0/5.08 2WAYS; ComponentLink1Description: Datasheet; ComponentLink1URL: 5mm screw terminal in SVN; Mounting Technology: Through Hole; PackageDescription: Socket, Screw Terminal Block, 2 Way, Pitch 5 mm, 90 Degree Angle, Through-Hole; Temperature Range: -40 to 105 degC
P8 = Header 2: Header, 2-Pin; LatestRevisionDate: 17-Jul-2002; LatestRevisionNote: Re-released for DXP Platform.; Publisher: Altium Limited
R26-R28 = R_0603: Specifications: *
TP9-TP13 TP17 = TP5001: as TP1 on sheet sensor; Datasheet URL: https://ciiva.com/datasheet-click-2917627?src=ciiva&sig=bd195616; Mounting Type: 0.040"(1.02mm)HoleDiameter; Family: TestPoints; RoHS Information: RoHSComplianceStatement; Datasheet Version: Rev. G, 12/2008; Color: Black; Category: TestandMeasurement; Standard Package: 100; Manufacturer URL: http://www.keyelco.com/; Material: Base,Nylon46,UL94V-0; Type: PCTestPoint,Miniature; Terminal: 0.010"x0.020"(0.25mmx0.51mm)PhosphorBronzeWire,SilverPlated; Series: THM; Packaging: Bulk
U8 = MCP6L01: as U7 on sheet power; Code_IPC: SOT23-5; ComponentLink3Description: Package Specification; PackageVersion: revBB, Aug-2009; ComponentLink3URL: http://www.microchip.com/stellent/groups/techpub_sg/documents/packagingspec/en012702.pdf; ComponentLink1Description: Manufacturer URL; DatasheetVersion: revB, Sep-2011; PackageDescription: 5-Lead Plastic Small Outline Transistor (OT) [SOT-23]; PackageReference: SOT-23-OT5; ComponentLink1URL: http://www.microchip.com/; ComponentLink2Description: Datasheet; ComponentLink2URL: http://ww1.microchip.com/downloads/en/DeviceDoc/22140b.pdf; RevisionNote: URLs added. DatasheetVersion updated.
J3 = MPT-02-01-XX-X-RA-SD: ComponentLink1Description: Manufacturer URL; ComponentLink3Description: Package Specification; ComponentLink2URL: http://cds.linear.com/docs/en/datasheet/4356fa.pdf; ComponentLink3URL: http://cds.linear.com/docs/en/packaging/05081661_F_MS.pdf; ComponentLink1URL: http://www.linear.com/; ComponentLink2Description: Datasheet

## Sheet thermocouple.SchDoc: Thermocouple Interface
size A4; SheetNumber: 6; SheetTotal: 7
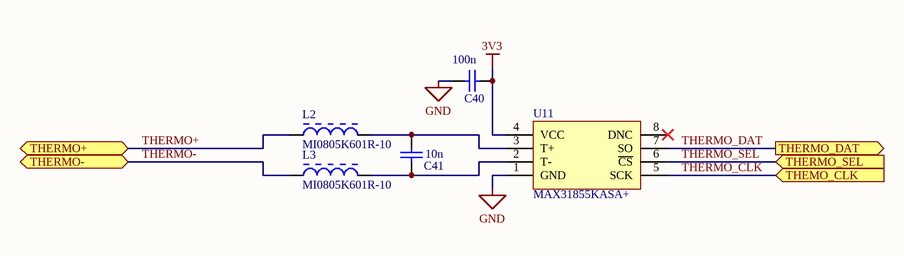
[diagram p4: thermocouple.SchDoc]

### Parts
C40  value 100n  [0805]  (hidden comment: Generic 0805 Capacitor)
C41  value 10n  [0805]  (hidden comment: Generic 0805 Capacitor)
L2  MI0805K601R-10  [0805]
L3  MI0805K601R-10  [0805]
U11  MAX31855KASA+  [SOIC8]

### Ports
THEMO_CLK (in), THERMO+ (bidir), THERMO- (bidir), THERMO_DAT (out), THERMO_SEL (in)

### Nets
3V3: C40.2 U11.4(VCC)
GND: C40.1 U11.1(GND)
THERMO+: L2.1 ; port THERMO+
THERMO-: L3.1 ; port THERMO-
THERMO_CLK: U11.5(SCK) ; port THEMO_CLK
THERMO_DAT: U11.7(SO) ; port THERMO_DAT
THERMO_SEL: U11.6(~{CS}) ; port THERMO_SEL
NetC41_1: C41.1 L3.2 U11.2(T-)
NetC41_2: C41.2 L2.2 U11.3(T+)

Not connected (* = marked no-connect by the designer): U11 8(DNC)*

### Notes on the sheet
- Title
- Title:
- Project:
- Size:
- Date:
- File:
- E
- Number:
- Time:
- Revision:
- Sheet
- of

### Library data of the parts
C40 C41 = C_0805: Specifications: *
L2 L3 = MI0805K: as L1 on sheet microcontroller; Standard Package: 1; Datasheet Version: Rev. A, 01/2004; Height (Max): 0.043"(1.10mm); Category: Filters; Operating Temperature: -40degC~125degC; Package Description: 2-Pin Surface Mount Device, Body 2 x 1.25 mm; Package / Case: 0805(2012Metric); Package Reference: MI0805K601R-10-2; Packaging: CutTape(CT); Ratings: -; Mounting Type: SurfaceMount; Datasheet URL: https://datasheet.ciiva.com/3082/mi0805k601r-10-a-vp-3082219.pdf; Size / Dimension: 0.079"Lx0.049"W(2.00mmx1.25mm); Family: FerriteBeadsandChips; Manufacturer URL: https://www.lairdtech.com; Series: MI
U11 = MAX31855: Cold-Junction Compensated / Thermocouple-to-Digital Converter; ComponentLink1Description: Manufacturer URL; ComponentLink3Description: Package Specification; ComponentLink2URL: http://cds.linear.com/docs/en/datasheet/4356fa.pdf; ComponentLink3URL: http://cds.linear.com/docs/en/packaging/05081661_F_MS.pdf; ComponentLink1URL: http://www.linear.com/; ComponentLink2Description: Datasheet

## Nets that join several sheets
3V3: sensor (C10.2 C11.2 U2.8), microcontroller (13 pins), power (7 pins), breakout (P3.5), thermocouple (C40.2 U11.4)
5V: sensor (C3.1 U1.17), power (7 pins), breakout (C34.2 C35.2 U8.5)
12V: sensor (C1.1 C2.2 U1.1), power (9 pins), breakout (J1.1)
GND: sensor (16 pins), microcontroller (17 pins), power (20 pins), breakout (23 pins), thermocouple (C40.1 U11.1)
VBAT: power (6 pins), breakout (6 pins)